# Altium schematic sheet Charge Interface.SchDoc
size A4; SheetNumber: 8; SheetTotal: 10
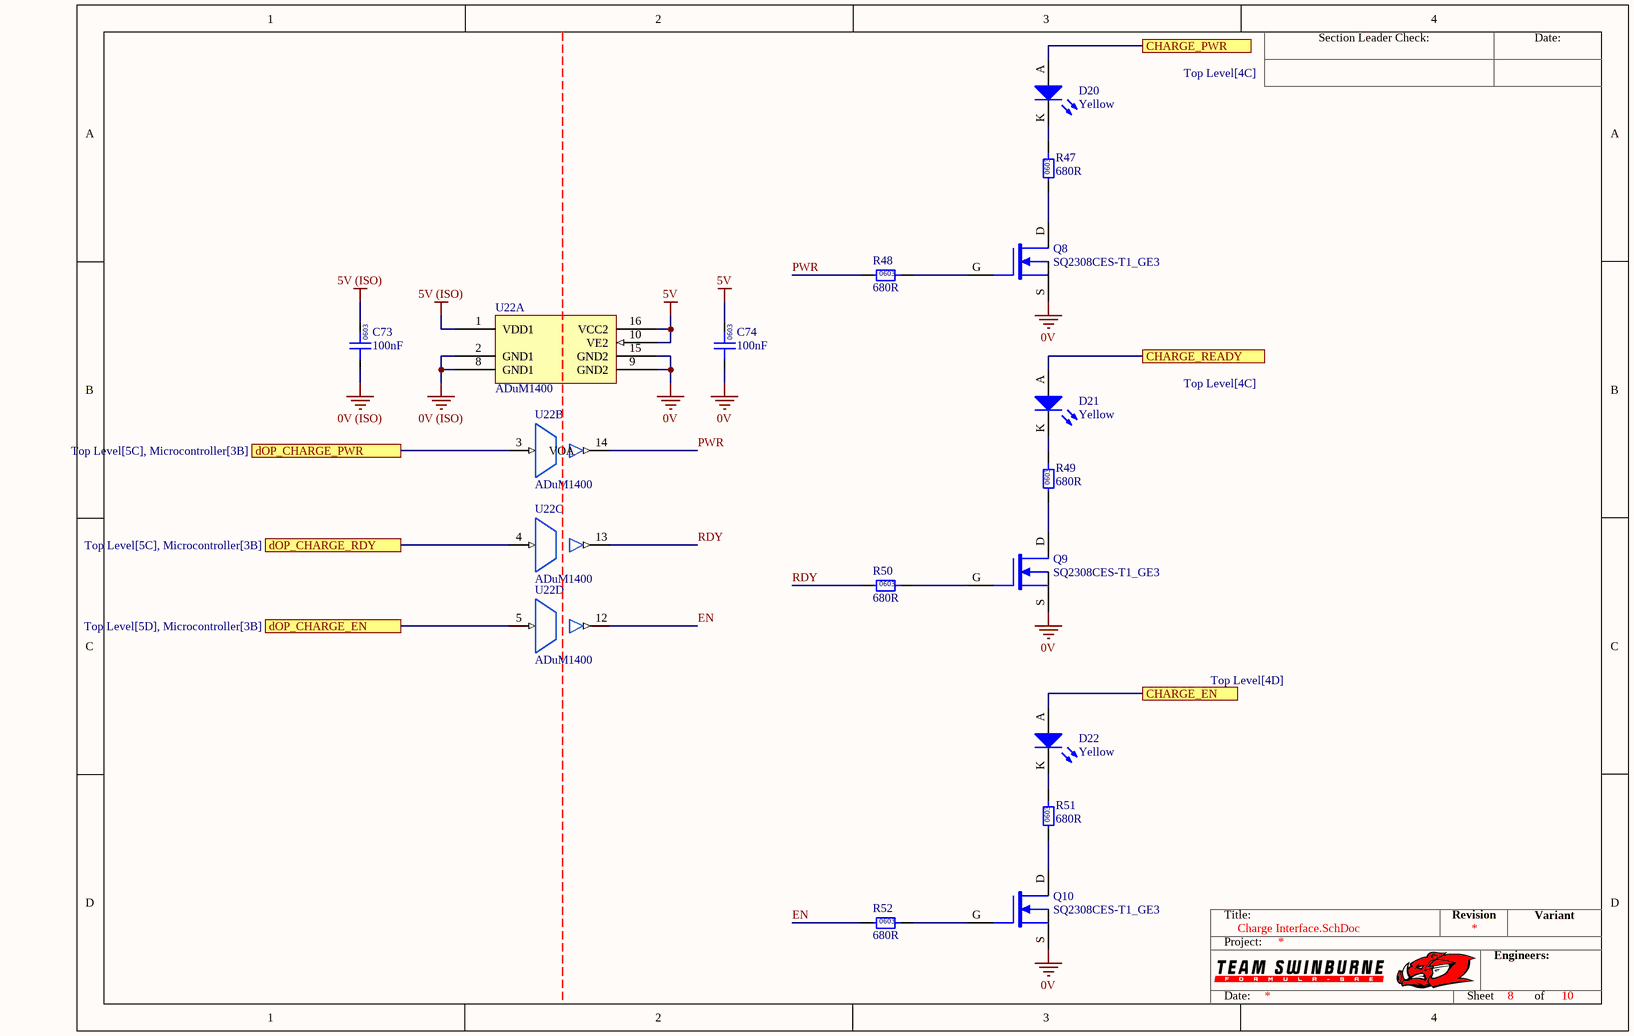
[diagram p0: Charge Interface.SchDoc]

## Parts
C73  100nF  [0603]
C74  100nF  [0603]
D20  Yellow  [0805 LED]
D21  Yellow  [0805 LED]
D22  Yellow  [0805 LED]
Q8  SQ2308CES-T1_GE3  [VSHY SOT-23-3]
Q9  SQ2308CES-T1_GE3  [VSHY SOT-23-3]
Q10  SQ2308CES-T1_GE3  [VSHY SOT-23-3]
R47  680R  [0603]
R48  680R  [0603]
R49  680R  [0603]
R50  680R  [0603]
R51  680R  [0603]
R52  680R  [0603]
U22  ADuM1400  [AD 16-SOIC]  (parts A,B,C,D of 5)

## Ports
CHARGE_EN (see Top Level[4D]), CHARGE_PWR (see Top Level[4C]), CHARGE_READY (see Top Level[4C]), dOP_CHARGE_EN (see Top Level[5D], Microcontroller[3B]), dOP_CHARGE_PWR (see Top Level[5C], Microcontroller[3B]), dOP_CHARGE_RDY (see Top Level[5C], Microcontroller[3B])

## Nets
0V: C74.1 Q8.S Q9.S Q10.S U22.9(GND2) U22.15(GND2)
0V (ISO): C73.1 U22.2(GND1) U22.8(GND1)
5V: C74.2 U22.10(VE2) U22.16(VCC2)
5V (ISO): C73.2 U22.1(VDD1)
CHARGE_EN: D22.A ; port CHARGE_EN
CHARGE_PWR: D20.A ; port CHARGE_PWR
CHARGE_READY: D21.A ; port CHARGE_READY
dOP_CHARGE_EN: U22.5(VIC) ; port dOP_CHARGE_EN
dOP_CHARGE_PWR: U22.3(VIA) ; port dOP_CHARGE_PWR
dOP_CHARGE_RDY: U22.4(VIB) ; port dOP_CHARGE_RDY
EN: R52.1 U22.12(VOC)
PWR: R48.1 U22.14(VOA)
RDY: R50.1 U22.13(VOB)
NetD20_K: D20.K R47.2
NetD21_K: D21.K R49.2
NetD22_K: D22.K R51.2
NetQ8_D: Q8.D R47.1
NetQ8_G: Q8.G R48.2
NetQ9_D: Q9.D R49.1
NetQ9_G: Q9.G R50.2
NetQ10_D: Q10.D R51.1
NetQ10_G: Q10.G R52.2

## Notes on the sheet
- Section Leader Check:
- Date:
- Title:
- Revision
- Variant
- Project:
- Engineers:
- Sheet
- of
- (in symbol GCM188L81H104KA57D) 0603
- (in symbol RC0603JR-13680RL) 0603

## Library data of the parts
C73 C74 = GCM188L81H104KA57D: Manufacturer: muRata; Rated Voltage: 50V; Tolerance: ±10%; Material: MLCC; Temperature Rating: X8L; Part Number: GCM188L81H104KA57D; Value: 100nF; Digikey Part Number: 490-6049-1-ND
D20-D22 = SML-211YTT86: Yellow LED Indication - Discrete 1.75V 0805 (2012 Metric); Manufacturer: ROHM Semiconductor; Part Number: SML-211YTT86; Colour: Yellow; Digikey Part Number: 511-1293-1-ND
Q8-Q10 = SQ2308CES-T1_GE3: MOSFET N-CH 60V 2.3A SOT23; Manufacturer: Vishay Siliconix; Type: N-channel; Rated Power: 2W; Published: 24-Mar-1999; LatestRevisionDate: 29-May-2009; LatestRevisionNote: IPC-7351 Footprint Added.; PackageVersion: Sep-2000; PackageReference: SOT-343; Publisher: Altium Limited; PackageDescription: 4-Pin SOT-343 Package 1.3 mm Pitch, 2.1 mm Lead Span; Part Number: SQ2308CES-T1_GE3; Digikey Part Number: SQ2308CES-T1_GE3CT-ND
R47-R52 = RC0603JR-13680RL: Manufacturer: YAGEO; Tolerance: 0.01; Rated Power: 0.1W; Part Number: RC0603JR-13680RL; Value: 680R; Material: FR-07; Digikey Part Number: 13-RC0603JR-13680RLCT-ND
U22 = ADuM1400: General Purpose Digital Isolator 2500Vrms 4 Channel 1Mbps 25kV/µs CMTI 16-SOIC (0.295", 7.50mm Width); Manufacturer: Analog Devices; Part Number: ADuM1400; Digikey Part Number: ADUM1400WSRWZ-ND; Digikey Link: https://www.digikey.com/product-detail/en/analog-devices-inc/ADUM1400WSRWZ/ADUM1400WSRWZ-ND/1873713